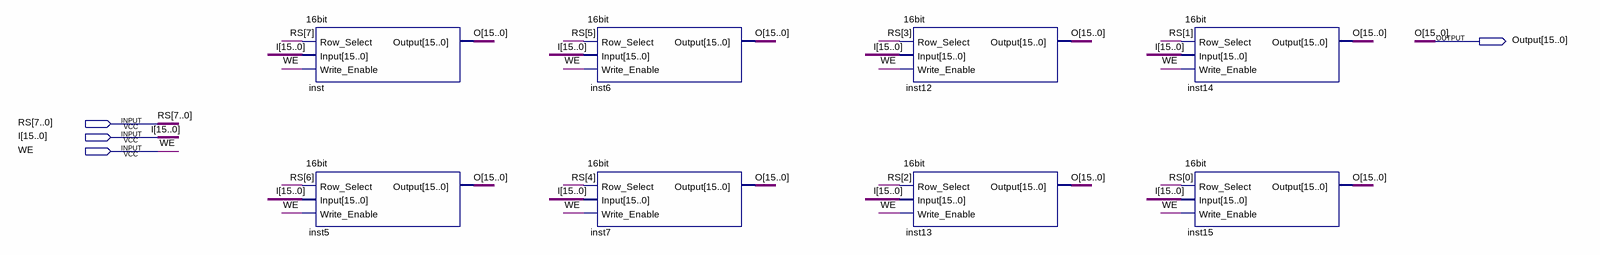
[diagram p0: schematic sheet]
// Quartus schematic dword2.bdf as structural Verilog: 8 symbols, 4 pins
module dword2 (
  input  [7:0] RS,
  input  [15:0] I,
  input  WE,
  output [15:0] Output
);

  \16bit  inst (.Row_Select(RS[7]), .Input(I), .Write_Enable(WE), .Output(Output));
  \16bit  inst5 (.Row_Select(RS[6]), .Input(I), .Write_Enable(WE), .Output(Output));
  \16bit  inst6 (.Row_Select(RS[5]), .Input(I), .Write_Enable(WE), .Output(Output));
  \16bit  inst7 (.Row_Select(RS[4]), .Input(I), .Write_Enable(WE), .Output(Output));
  \16bit  inst12 (.Row_Select(RS[3]), .Input(I), .Write_Enable(WE), .Output(Output));
  \16bit  inst13 (.Row_Select(RS[2]), .Input(I), .Write_Enable(WE), .Output(Output));
  \16bit  inst14 (.Row_Select(RS[1]), .Input(I), .Write_Enable(WE), .Output(Output));
  \16bit  inst15 (.Row_Select(RS[0]), .Input(I), .Write_Enable(WE), .Output(Output));

  // Other names for the same wires on the sheet: O[15:0] = Output
endmodule
